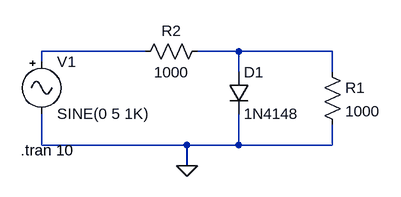
[diagram p0: schematic Draft2.asc]
Draft2.asc, the LTspice schematic file:
Version 4
SHEET 1 880 680
WIRE -48 64 -208 64
WIRE 96 64 32 64
WIRE 240 64 96 64
WIRE -208 80 -208 64
WIRE 96 96 96 64
WIRE 240 96 240 64
WIRE -208 208 -208 160
WIRE 16 208 -208 208
WIRE 96 208 96 160
WIRE 96 208 16 208
WIRE 240 208 240 176
WIRE 240 208 96 208
WIRE 16 240 16 208
FLAG 16 240 0
SYMBOL res 224 80 R0
SYMATTR InstName R1
SYMATTR Value 1000
SYMBOL res 48 48 R90
WINDOW 0 0 56 VBottom 2
WINDOW 3 32 56 VTop 2
SYMATTR InstName R2
SYMATTR Value 1000
SYMBOL diode 80 96 R0
SYMATTR InstName D1
SYMATTR Value 1N4148
SYMBOL Misc\\signal -208 64 R0
WINDOW 123 0 0 Left 0
WINDOW 39 0 0 Left 0
SYMATTR InstName V1
SYMATTR Value SINE(0 5 1K)
TEXT -240 216 Left 2 !.tran 10

The netlist it stands for:
* Draft2.asc
R1 N002 0 1000
R2 N002 N001 1000
D1 N002 0 1N4148
V1 N001 0 SINE(0 5 1K)
.model D D
.lib standard.dio
.tran 10
.backanno
.end